# EAGLE design HW2 (EAGLE 8.1.0)
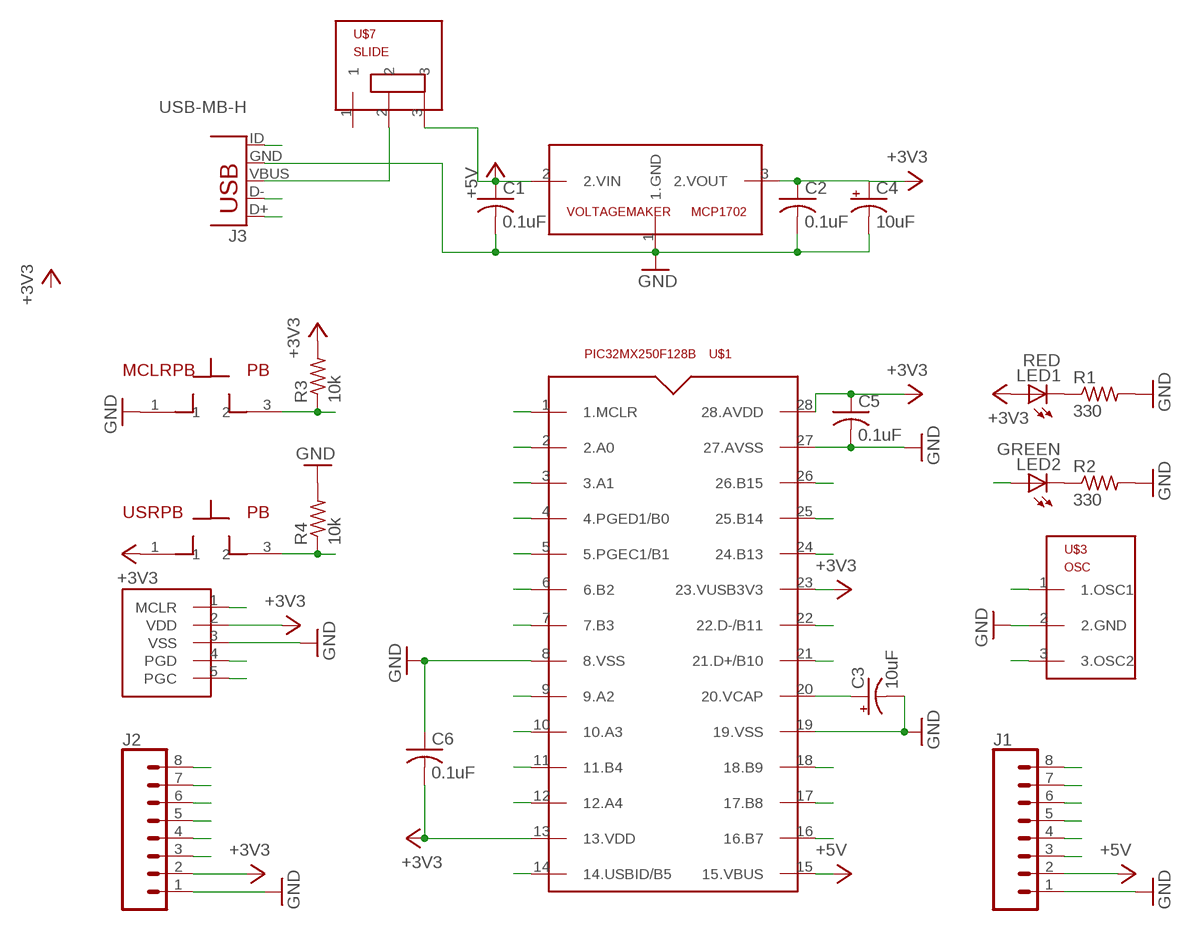
[diagram p0: schematic, sheet 1]

## Parts
C1  0.1uF  C-US025-025X050  [C025-025X050]
C2  0.1uF  C-US025-025X050  [C025-025X050]
C3  10uF  CPOL-USB45181B  [B45181B]
C4  10uF  CPOL-USB45181B  [B45181B]
C5  0.1uF  C-US025-025X050  [C025-025X050]
C6  0.1uF  C-US025-025X050  [C025-025X050]
J1  CONN_08"  [1X08]
J2  CONN_08"  [1X08]
J3  USB-MB-H  [USB-MB-H]
LED1  RED  LED3MM  [LED3MM]
LED2  GREEN  LED3MM  [LED3MM]
MCLRPB  PB  [PB]
R1  330  R-US_0204/7  [0204/7]
R2  330  R-US_0204/7  [0204/7]
R3  10k  R-US_0204/7  [0204/7]
R4  10k  R-US_0204/7  [0204/7]
U$1  PIC32MX250F128B  [DIL28-3]
U$3  OSC  [OSC]
U$6  PICKIT  [PICKIT]
U$7  SLIDE  [SLIDE]
USRPB  PB  [PB]
VOLTAGEMAKER  MCP1702  [TO92]

## Nets
+3V3: C2.1 C4.+ C5.1 C6.2 J2.2 LED1.A R3.2 U$1.13(13.VDD) U$1.23(23.VUSB3V3) U$1.28(28.AVDD) U$6.2(VDD) USRPB.1 VOLTAGEMAKER.3(2.VOUT)
+5V: C1.1 J1.2 U$1.15(15.VBUS) U$7.3 VOLTAGEMAKER.2(2.VIN)
A0: J2.8 U$1.2(2.A0)
A1: J2.7 U$1.3(3.A1)
A2: U$1.9(9.A2) U$3.1(1.OSC1)
A3: U$1.10(10.A3) U$3.3(3.OSC2)
A4: J2.3 LED2.A U$1.12(12.A4)
B2: J2.6 U$1.6(6.B2)
B3: J2.5 U$1.7(7.B3)
B4: J2.4 R4.1 U$1.11(11.B4) USRPB.3
B7: J1.3 U$1.16(16.B7)
B8: J1.4 U$1.17(17.B8)
B9: J1.5 U$1.18(18.B9)
B13: J1.6 U$1.24(24.B13)
B14: J1.7 U$1.25(25.B14)
B15: J1.8 U$1.26(26.B15)
D+: J3.D+ U$1.21(21.D+/B10)
D-: J3.D- U$1.22(22.D-/B11)
GND: C1.2 C2.2 C3.- C4.- C5.2 C6.1 J1.1 J2.1 J3.GND MCLRPB.1 R1.2 R2.2 R4.2 U$1.8(8.VSS) U$1.19(19.VSS) U$1.27(27.AVSS) U$3.2(2.GND) U$6.3(VSS) VOLTAGEMAKER.1(1.GND)
ID: J3.ID U$1.14(14.USBID/B5)
MCLR: MCLRPB.3 R3.1 U$1.1(1.MCLR) U$6.1(MCLR)
N$2: J3.VBUS U$7.2
N$6: LED1.K(C) R1.1
N$28: C3.+ U$1.20(20.VCAP)
N$30: LED2.K(C) R2.1
PGC: U$1.5(5.PGEC1/B1) U$6.5(PGC)
PGD: U$1.4(4.PGED1/B0) U$6.4(PGD)
Unconnected: U$7.1

## Library data of the parts
C1 C2 C5 C6 = HW2:C-US: CAPACITOR, American symbol
C3 C4 = HW2:CPOL-US: POLARIZED CAPACITOR, American symbol
J1 J2 = HW2:CONN_08: Multi connection point. Often used as Generic Header-pin footprint for 0.1 inch spaced/style header connections On any of the 0.1 inch spaced packages, you can populate with these: Break Away Headers - Straight <https://www.sparkfun.com/products/116> (PRT-00116) Break Away Male Headers - Right Angle <https://www.sparkfun.com/products/553> (PRT-00553) Female Headers <https://www.sparkfun.com/products/115> (PRT-00115) Break Away Headers - Machine Pin <https://www.sparkfun.com/products/117> (PRT-00117) Break Away Female Headers - Swiss Machine Pin <https://www.sparkfun.com/products/743> (PRT-00743) Arduino Stackable Header - 8 Pin <https://www.sparkfun.com/products/9279> (PRT-09279) For SCREWTERMINALS and SPRING TERMINALS visit here: Screw Terimnals on SparkFun.com <https://www.sparkfun.com/search/results?term=Screw+Terminals> (5mm/3.5mm/2.54mm spacing) This device is also useful as a general connection point to wire up your design to another part of your project. Our various solder wires solder well into these plated through hole pads. Hook-Up Wire - Assortment (Stranded, 22 AWG) <https://www.sparkfun.com/products/11375> (PRT-11375) Hook-Up Wire - Assortment (Solid Core, 22 AWG) <https://www.sparkfun.com/products/11367> (PRT-11367) View the entire wire category on our website here <https://www.sparkfun.com/categories/141> Special notes: Molex polarized connector foot print use with SKU : PRT-08231 with associated crimp pins and housings. 1MM SMD Version SKU: PRT-10208 NOTES ON THE VARIANTS LOCK and LOCK_LONGPADS... This footprint was designed to help hold the alignment of a through-hole component (i.e. 6-pin header) while soldering it into place. You may notice that each hole has been shifted either up or down by 0.005 of an inch from it's more standard position (which is a perfectly straight line). This slight alteration caused the pins (the squares in the middle) to touch the edges of the holes. Because they are alternating, it causes a "brace" to hold the component in place. 0.005 has proven to be the perfect amount of "off-center" position when using our standard breakaway headers. Although looks a little odd when you look at the bare footprint, once you have a header in there, the alteration is very hard to notice. Also,if you push a header all the way into place, it is covered up entirely on the bottom side.; PROD_ID: CONN-08438
J3 = HW2:USB: USB Connectors USB-B-PTH is fully proven SKU : PRT-00139/CONN-08278 USB-miniB is fully proven SKU : PRT-00587 USB-A-PCB is untested. USB-A-H is throughly reviewed, but untested. Spark Fun Electronics SKU : PRT-00437 USB-B-SMT is throughly reviewed, but untested. Needs silkscreen touching up. USB-A-S has not been used/tested USB-MB-H has not been used/tested USB-MICROB has been used. CONN-09505
LED1 LED2 = HW2:LED: LED OSRAM: - CHIPLED LG R971, LG N971, LY N971, LG Q971, LY Q971, LO R971, LY R971 LH N974, LH R974 LS Q976, LO Q976, LY Q976 LO Q996 - Hyper CHIPLED LW Q18S LB Q993, LB Q99A, LB R99A - SideLED LS A670, LO A670, LY A670, LG A670, LP A670 LB A673, LV A673, LT A673, LW A673 LH A674 LY A675 LS A676, LA A676, LO A676, LY A676, LW A676 LS A679, LY A679, LG A679 - Hyper Micro SIDELED® LS Y876, LA Y876, LO Y876, LY Y876 LT Y87S - SmartLED LW L88C, LW L88S LB L89C, LB L89S, LG L890 LS L89K, LO L89K, LY L89K LS L896, LA L896, LO L896, LY L896 - TOPLED LS T670, LO T670, LY T670, LG T670, LP T670 LSG T670, LSP T670, LSY T670, LOP T670, LYG T670 LG T671, LOG T671, LSG T671 LB T673, LV T673, LT T673, LW T673 LH T674 LS T676, LA T676, LO T676, LY T676, LB T676, LH T676, LSB T676, LW T676 LB T67C, LV T67C, LT T67C, LS T67K, LO T67K, LY T67K, LW E67C LS E67B, LA E67B, LO E67B, LY E67B, LB E67C, LV E67C, LT E67C LW T67C LS T679, LY T679, LG T679 LS T770, LO T770, LY T770, LG T770, LP T770 LB T773, LV T773, LT T773, LW T773 LH T774 LS E675, LA E675, LY E675, LS T675 LS T776, LA T776, LO T776, LY T776, LB T776 LHGB T686 LT T68C, LB T68C - Hyper Mini TOPLED® LB M676 - Mini TOPLED Santana® LG M470 LS M47K, LO M47K, LY M47K Source: http://www.osram.convergy.de LUXEON: - LUMILED® LXK2-PW12-R00, LXK2-PW12-S00, LXK2-PW14-U00, LXK2-PW14-V00 LXK2-PM12-R00, LXK2-PM12-S00, LXK2-PM14-U00 LXK2-PE12-Q00, LXK2-PE12-R00, LXK2-PE12-S00, LXK2-PE14-T00, LXK2-PE14-U00 LXK2-PB12-K00, LXK2-PB12-L00, LXK2-PB12-M00, LXK2-PB14-N00, LXK2-PB14-P00, LXK2-PB14-Q00 LXK2-PR12-L00, LXK2-PR12-M00, LXK2-PR14-Q00, LXK2-PR14-R00 LXK2-PD12-Q00, LXK2-PD12-R00, LXK2-PD12-S00 LXK2-PH12-R00, LXK2-PH12-S00 LXK2-PL12-P00, LXK2-PL12-Q00, LXK2-PL12-R00 Source: www.luxeon.com KINGBRIGHT: KA-3528ASYC Source: www.kingbright.com
MCLRPB USRPB = HW2:PB
R1-R4 = HW2:R-US_: RESISTOR, American symbol
U$1 = HW2:PIC32MX250F128B
U$3 = HW2:OSC
U$6 = HW2:PICKIT
U$7 = HW2:SLIDE
VOLTAGEMAKER = HW2:MCP1702

## Board
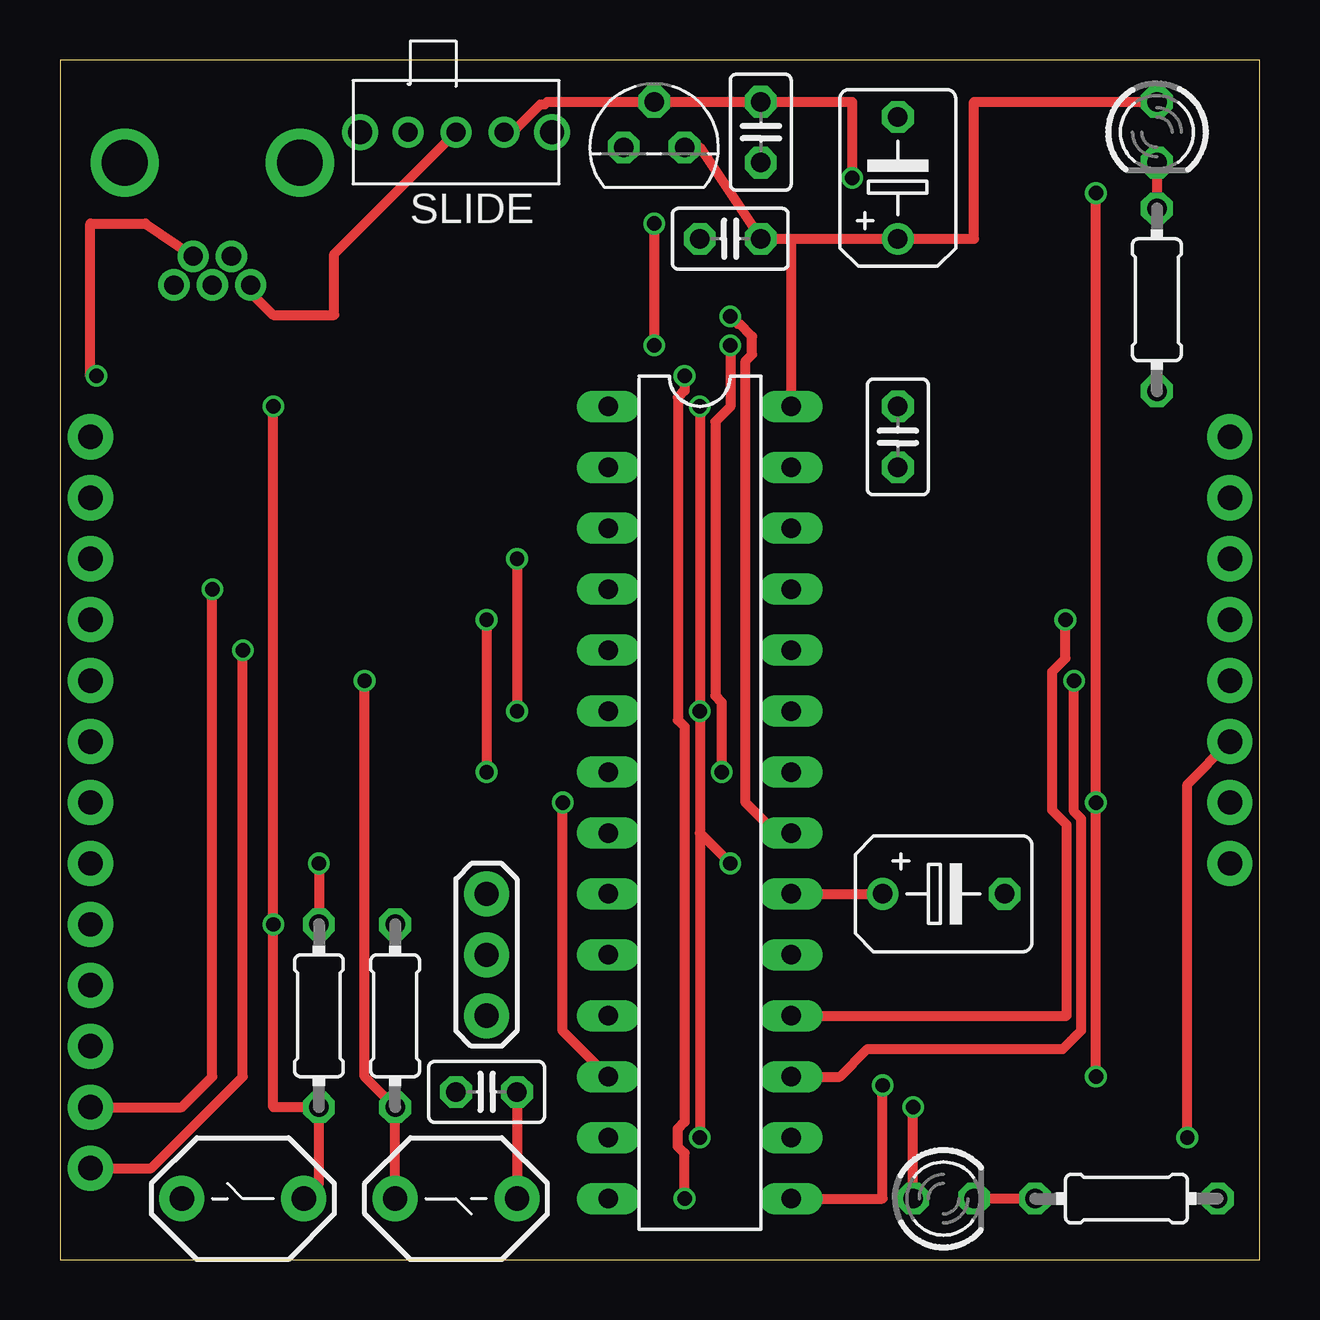
[diagram p1: board, top side]
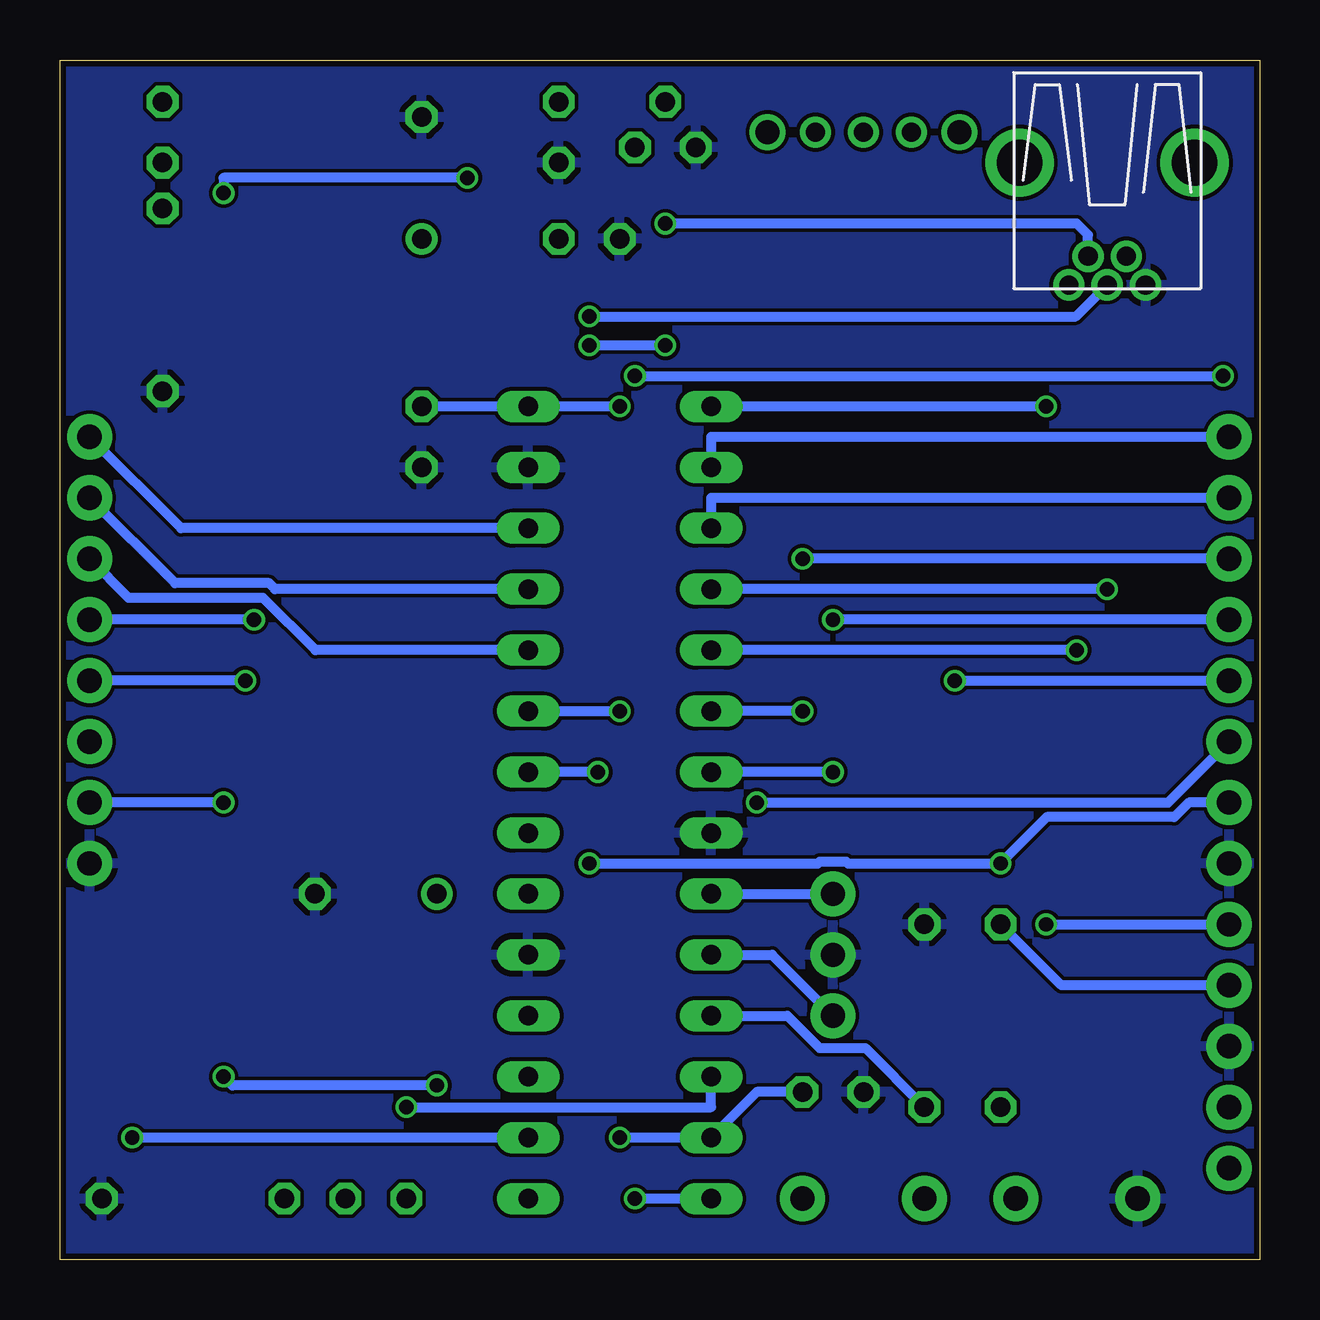
[diagram p2: board, bottom side, seen from below]

Size 50 x 50 mm. Coordinates in mm from the lower left corner, seen from the top.
Outline: 0,0 50,0 50,50 0,50 0,0
Copper layers (1*16): Top 0.035mm / dielectric 1.5mm / Bottom 0.035mm
Design rules "SeeedStudio_2layer_DRU_no_angle_20140221": minimum track width 6mil, minimum drill 12mil, track to track 6mil, track to pad 6mil, pad to pad 6mil, via to via 6mil, smd to smd 0mil, copper to edge 10mil, drill to drill 10mil, minimum pad ring 10mil, minimum via ring 6mil, stop-mask expansion 2mil, vias tented up to drill 100mil, thermal gap 10mil

### Footprints (pad centres in the part's own frame; a part is rotated, then mirrored left to right if it is on the bottom)
C025-025X050 = drill 0.813 octagon: 1 -1.27,0; 2 1.27,0
B45181B = drill 0.813: + -2.54,0 | drill 0.813 octagon: - 2.54,0
1X08 = drill 1.016 pad 1.88: 1 0,0; 2 2.54,0; 3 5.08,0; 4 7.62,0; 5 10.16,0; 6 12.7,0; 7 15.24,0; 8 17.78,0
USB-MB-H = drill 0.8: D+ 5.1,0; D- 3.9,0.8; GND 5.1,-1.6; ID 3.9,-0.8; VBUS 5.1,1.6 | drill 1.9: P$6 0,-3.65; P$7 0,3.65
LED3MM = drill 0.813 octagon: A -1.27,0; K 1.27,0
PB = drill 1.016 pad 1.88: 1 -2.54,0; 3 2.54,0
0204/7 = drill 0.813 octagon: 1 -3.81,0; 2 3.81,0
DIL28-3 = drill 0.813 long: 1 -16.51,-3.81; 2 -13.97,-3.81; 3 -11.43,-3.81; 4 -8.89,-3.81; 5 -6.35,-3.81; 6 -3.81,-3.81; 7 -1.27,-3.81; 8 1.27,-3.81; 9 3.81,-3.81; 10 6.35,-3.81; 11 8.89,-3.81; 12 11.43,-3.81; 13 13.97,-3.81; 14 16.51,-3.81; 15 16.51,3.81; 16 13.97,3.81; 17 11.43,3.81; 18 8.89,3.81; 19 6.35,3.81; 20 3.81,3.81; 21 1.27,3.81; 22 -1.27,3.81; 23 -3.81,3.81; 24 -6.35,3.81; 25 -8.89,3.81; 26 -11.43,3.81; 27 -13.97,3.81; 28 -16.51,3.81
OSC = drill 1.016 pad 1.88: 1 -2.54,0; 2 0,0; 3 2.54,0
PICKIT = drill 1.016 pad 1.88: 1 -5.08,0; 2 -2.54,0; 3 0,0; 4 2.54,0; 5 5.08,0
SLIDE = drill 0.8: 1 -2,0; 2 0,0; 3 2,0 | drill 1: P$1 -4,0; P$2 4,0
TO92 = drill 0.813 octagon: 1 -1.27,0; 2 0,1.905; 3 1.27,0

### Placement (x,y rotation side)
C1  29.21,46.99 270 top
C2  27.94,42.55 180 top
C3  36.83,15.24 0 top
C4  34.92,45.09 90 top
C5  34.92,34.29 270 top
C6  17.78,6.99 0 top
J1  48.77,16.51 90 top
J2  1.27,16.51 90 top
J3  6.35,45.72 270 top
LED1  45.72,46.99 270 top
LED2  36.83,2.54 0 top
MCLRPB  7.62,2.54 0 top
R1  45.72,40.01 270 top
R2  44.45,2.54 0 top
R3  10.79,10.16 90 top
R4  13.97,10.16 90 top
U$1  26.67,19.05 270 top
U$3  17.78,12.7 270 top
U$6  1.27,8.89 270 top
U$7  16.51,46.99 0 top
USRPB  16.51,2.54 180 top
VOLTAGEMAKER  24.77,46.35 0 top

### Tracks (layer width: path | path; a pad name or v marks a point on that pad's centre or on a via)
+3V3  (via drill 0.6)
  Top 0.406: VOLTAGEMAKER.3 26.67,46.35 C2.1 | C2.1 C4.+ 38.1,42.55 38.1,48.26 LED1.A | C2.1 30.48,42.55 U$1.28 | v26.67,35.56 v26.67,22.86 26.67,17.78 | 26.67,17.78 v26.67,5.08 | C6.2 USRPB.1 | v10.79,16.51 R3.2 | 26.67,17.78 v27.94,16.51
  Bottom 0.406: v26.67,5.08 U$1.13 20.95,6.99 C6.2 | U$1.23 v26.67,22.86 | v26.67,35.56 U$1.28 C5.1 | U$6.2 8.26,11.43 R3.2 | J2.2 2.95,19.05 3.56,18.44 8.87,18.44 v10.79,16.51 17.15,16.51 17.22,16.59 18.34,16.59 18.41,16.51 v27.94,16.51
+5V  (via drill 0.6)
  Top 0.406: U$7.3 18.87,46.99 20.03,48.15 20.21,48.15 20.32,48.26 VOLTAGEMAKER.2 C1.1 33.02,48.26 v33.02,45.09 | v43.18,44.45 v43.18,19.05 v43.18,7.62 | U$1.15 34.29,2.54 v34.29,7.26
  Bottom 0.406: v33.02,45.09 43.18,45.09 v43.18,44.45 | v43.18,19.05 J1.2 | v34.29,7.26 42.82,7.26 v43.18,7.62
A0
  Bottom 0.406: J2.8 22.86,34.29 U$1.2
A1
  Bottom 0.406: J2.7 22.86,31.75 U$1.3
A2
  Bottom 0.406: U$1.9 U$3.1
A3
  Bottom 0.406: U$1.10 20.32,12.7 U$3.3
A4  (via drill 0.6)
  Top 0.406: LED2.A v35.56,6.35 | U$1.12 20.95,9.53 v20.95,19.05
  Bottom 0.406: v35.56,6.35 22.86,6.35 U$1.12 | v20.95,19.05 3.81,19.05 J2.3
B2  (via drill 0.6)
  Top 0.406: v19.05,29.21 v19.05,22.86
  Bottom 0.406: J2.6 v19.05,29.21 | v19.05,22.86 U$1.6
B3  (via drill 0.6)
  Top 0.406: v17.78,26.67 v17.78,20.32
  Bottom 0.406: J2.5 v17.78,26.67 | v17.78,20.32 U$1.7
B4  (via drill 0.6)
  Top 0.406: USRPB.3 R4.1 12.7,7.62 v12.7,24.13
  Bottom 0.406: U$1.11 19.68,10.16 18.34,8.81 16.43,8.81 R4.1 | v12.7,24.13 J2.4
B7  (via drill 0.6)
  Top 0.406: v46.99,5.08 46.99,19.81 J1.3
  Bottom 0.406: U$1.16 v46.99,5.08
B8  (via drill 0.6)
  Top 0.406: U$1.17 32.5,7.62 33.66,8.78 41.8,8.78 42.57,9.55 42.57,18.37 42.27,18.67 v42.27,24.13
  Bottom 0.406: v42.27,24.13 J1.4
B9  (via drill 0.6)
  Top 0.406: U$1.18 41.96,10.16 41.96,18.12 41.36,18.72 41.36,24.51 41.91,25.06 v41.91,26.67
  Bottom 0.406: v41.91,26.67 J1.5
B13
  Bottom 0.406: J1.6 47.14,27.58 41.53,27.58 39.35,25.4 U$1.24
B14
  Bottom 0.406: U$1.25 41.03,27.94 41.28,28.19 45.21,28.19 J1.7
B15
  Bottom 0.406: U$1.26 44.96,30.48 J1.8
D+  (via drill 0.6)
  Top 0.406: U$1.21 29.84,17.78 28.57,19.05 28.57,37.45 28.85,37.72 28.85,38.48 28.32,39.01 28.24,39.01 v27.94,39.31
  Bottom 0.406: v27.94,39.31 7.66,39.31 J3.D+
D-  (via drill 0.6)
  Top 0.406: v24.77,43.18 v24.77,38.1 | v27.94,38.1 27.94,35.54 27.31,34.92 27.31,23.5 27.58,23.24 v27.58,20.32
  Bottom 0.406: J3.D- 7.15,42.71 7.62,43.18 v24.77,43.18 | v24.77,38.1 v27.94,38.1 | v27.58,20.32 U$1.22
GND
  pour Bottom: 0,0 50.16,0 50.16,10.16 50.16,50.16 0,50.16
ID  (via drill 0.6)
  Top 0.406: v26.04,2.54 26.04,4.43 25.76,4.7 25.76,5.46 26.04,5.73 26.04,22.21 25.76,22.48 25.76,35.94 26.04,36.21 v26.04,36.83 | v1.52,36.83 1.27,36.83 1.27,43.18 3.56,43.18 J3.ID
  Bottom 0.406: U$1.14 v26.04,2.54 | v26.04,36.83 v1.52,36.83
MCLR  (via drill 0.6)
  Top 0.406: MCLRPB.3 10.79,3.17 R3.1 8.89,6.35 v8.89,13.97 v8.89,35.56
  Bottom 0.406: v8.89,13.97 U$6.1 | v8.89,35.56 U$1.1
N$2
  Top 0.406: J3.VBUS 7.95,40.31 8.89,39.37 11.43,39.37 11.43,41.91 U$7.2
N$6
  Top 0.406: LED1.K R1.1
N$28
  Top 0.406: U$1.20 C3.+
N$30
  Top 0.406: R2.1 LED2.K
PGC  (via drill 0.6)
  Top 0.406: U$6.5 3.81,3.81 7.62,7.62 v7.62,25.4
  Bottom 0.406: v7.62,25.4 U$1.5
PGD  (via drill 0.6)
  Top 0.406: U$6.4 5.08,6.35 6.35,7.62 v6.35,27.94
  Bottom 0.406: v6.35,27.94 U$1.4